# Altium schematic sheet LED1710050926.SchDoc
size A4
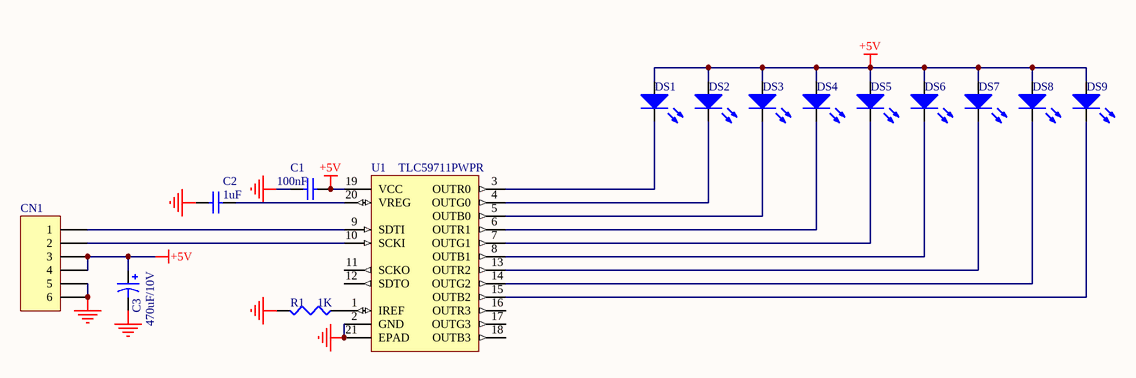
[diagram p0: LED1710050926.SchDoc]

## Parts
C1  100nF  [C0603-3]
C2  1uF  [C0603-3]
C3  470uF/10V  [CASE-D_7343]
CN1  (no value)  [FFC/SM1.0-2H6]
DS1  (no value)  [LED2-2.54-5C]
DS2  (no value)  [LED2-2.54-5C]
DS3  (no value)  [LED2-2.54-5C]
DS4  (no value)  [LED2-2.54-5C]
DS5  (no value)  [LED2-2.54-5C]
DS6  (no value)  [LED2-2.54-5C]
DS7  (no value)  [LED2-2.54-5C]
DS8  (no value)  [LED2-2.54-5C]
DS9  (no value)  [LED2-2.54-5C]
R1  1K  [R0603-3]
U1  TLC59711PWPR  [HTSSOP20]

## Nets
+5V: C1.1 C3.1 CN1.3 CN1.4 DS1.1(A) DS2.1(A) DS3.1(A) DS4.1(A) DS5.1(A) DS6.1(A) DS7.1(A) DS8.1(A) DS9.1(A) U1.19(VCC)
GND: C1.2 C2.2 C3.2 CN1.5 CN1.6 R1.2 U1.2(GND) U1.21(EPAD)
NetC2_1: C2.1 U1.20(VREG)
NetCN1_1: CN1.1 U1.9(SDTI)
NetCN1_2: CN1.2 U1.10(SCKI)
NetDS1_2: DS1.2(K) U1.3(OUTR0)
NetDS2_2: DS2.2(K) U1.4(OUTG0)
NetDS3_2: DS3.2(K) U1.5(OUTB0)
NetDS4_2: DS4.2(K) U1.6(OUTR1)
NetDS5_2: DS5.2(K) U1.7(OUTG1)
NetDS6_2: DS6.2(K) U1.8(OUTB1)
NetDS7_2: DS7.2(K) U1.13(OUTR2)
NetDS8_2: DS8.2(K) U1.14(OUTG2)
NetDS9_2: DS9.2(K) U1.15(OUTB2)
NetR1_1: R1.1 U1.1(IREF)

Not connected (* = marked no-connect by the designer): U1 11(SCKO) 12(SDTO) 16(OUTR3) 17(OUTG3) 18(OUTB3)

## Library data of the parts
C1 C2 = Cap: Capacitor; Value: 100pF; Published: 8-Jun-2000; LatestRevisionDate: 17-Jul-2002; LatestRevisionNote: Re-released for DXP Platform.; PackageReference: RAD-0.3; Publisher: Altium Limited
C3 = Cap Pol1: Polarized Capacitor (Radial); Value: 100pF; Published: 8-Jun-2000; LatestRevisionDate: 17-Jul-2002; LatestRevisionNote: Re-released for DXP Platform.; PackageReference: RB7.6-15; Publisher: Altium Limited; PackageDescription: Polarized Capacitor (Radial); 2 Leads
CN1 = Header 6: Header, 6-Pin; LatestRevisionDate: 17-Jul-2002; LatestRevisionNote: Re-released for DXP Platform.; Publisher: Altium Limited
DS1-DS9 = LED0: Typical INFRARED GaAs LED; Published: 8-Jun-2000; LatestRevisionDate: 08-Jul-2005; LatestRevisionNote: Mech Layer 1 removed.; PackageReference: LED-0; Publisher: Altium Limited; PackageDescription: LED; 2 Leads
R1 = Res3: Resistor; Published: 8-Jun-2000; LatestRevisionDate: 29-May-2009; LatestRevisionNote: IPC-7351 Footprint Added.; PackageReference: J1-0603; Publisher: Altium Limited; PackageDescription: Chip Resistor; Value: 1K
U1 = TLC59711: 12-Channel,16-Bit,LED Driver with 3.3-V Linear Ragulator